# EAGLE schematic MultimeterOld (EAGLE 9.6.2)

## Sheet 1 of 2: ADC
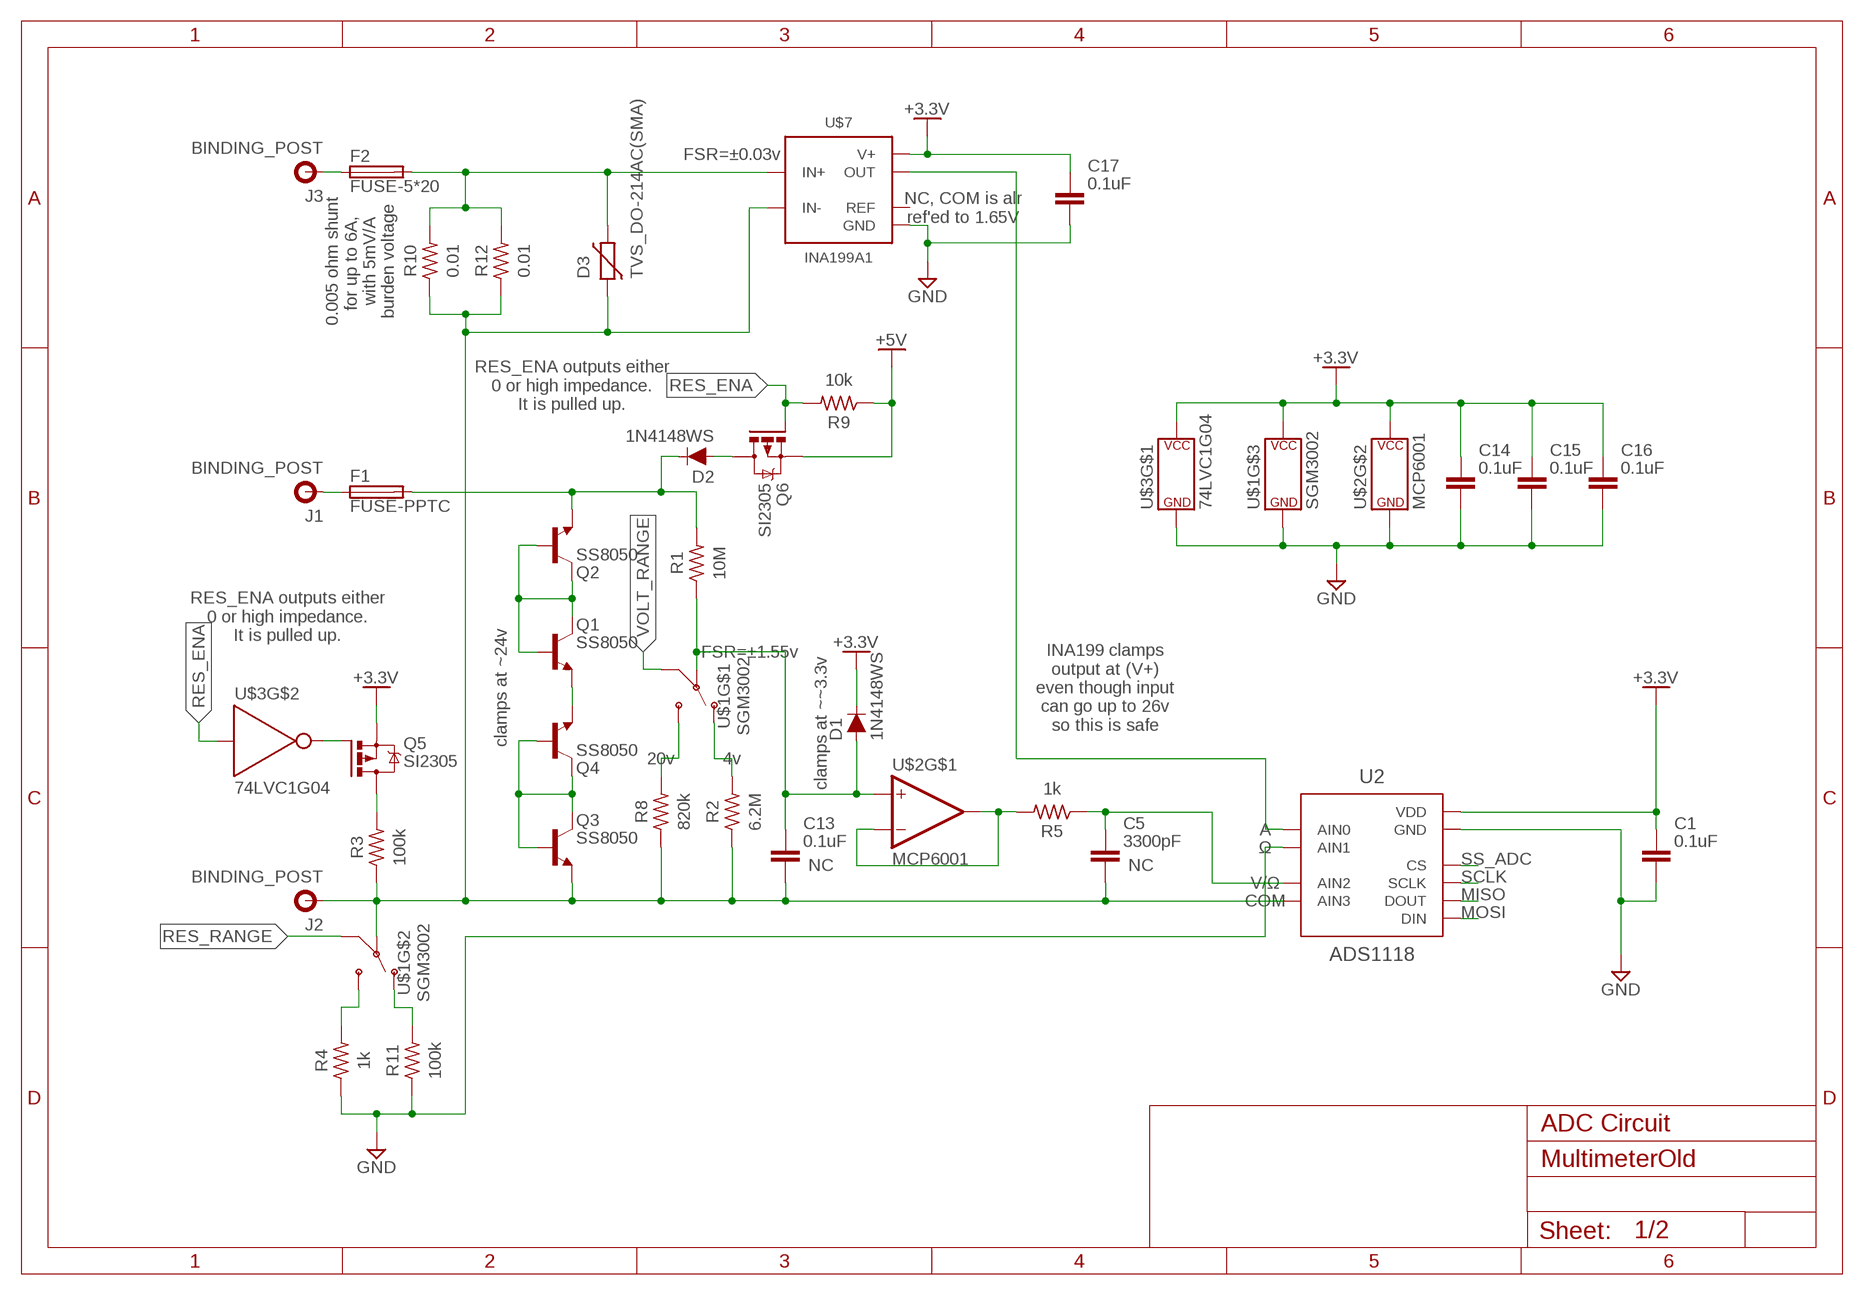
[diagram p0: schematic, sheet 1]

### Parts
C1  0.1uF  C_CHIP-0603(1608-METRIC)  [CAPC1608X85]
C5  3300pF  C_CHIP-0603(1608-METRIC)  [CAPC1608X85]
C13  0.1uF  C_CHIP-0603(1608-METRIC)  [CAPC1608X85]
C14  0.1uF  C_CHIP-0603(1608-METRIC)  [CAPC1608X85]
C15  0.1uF  C_CHIP-0603(1608-METRIC)  [CAPC1608X85]
C16  0.1uF  C_CHIP-0603(1608-METRIC)  [CAPC1608X85]
C17  0.1uF  C_CHIP-0603(1608-METRIC)  [CAPC1608X85]
D1  1N4148WS  DIODE  [SOD-323]
D2  1N4148WS  DIODE  [SOD-323]
D3  TVS_DO-214AC(SMA)  [DIOM5226X290N]
F1  FUSE-PPTC  [FUSE-PPTC-TH]
F2  FUSE-5*20  [FUSEHOLDER_"HD"]
J1  BINDING_POST  [BINDING_POST]
J2  BINDING_POST  [BINDING_POST]
J3  BINDING_POST  [BINDING_POST]
Q1  SS8050  NPN_SOT23  [SOT95P237X112-3N]
Q2  SS8050  NPN_SOT23  [SOT95P237X112-3N]
Q3  SS8050  NPN_SOT23  [SOT95P237X112-3N]
Q4  SS8050  NPN_SOT23  [SOT95P237X112-3N]
Q5  SI2305  PMOSFET_SOT23  [SOT23]
Q6  SI2305  PMOSFET_SOT23  [SOT23]
R1  10M  R-US_CHIP-0603(1608-METRIC)  [RESC1608X60]
R2  6.2M  R-US_CHIP-0603(1608-METRIC)  [RESC1608X60]
R3  100k  R-US_CHIP-0603(1608-METRIC)  [RESC1608X60]
R4  1k  R-US_CHIP-0603(1608-METRIC)  [RESC1608X60]
R5  1k  R-US_CHIP-0603(1608-METRIC)  [RESC1608X60]
R8  820k  R-US_CHIP-0603(1608-METRIC)  [RESC1608X60]
R9  10k  R-US_CHIP-0603(1608-METRIC)  [RESC1608X60]
R10  0.01  R-US_CHIP-2512(6332-METRIC)  [RESC6332X71]
R11  100k  R-US_CHIP-0603(1608-METRIC)  [RESC1608X60]
R12  0.01  R-US_CHIP-2512(6332-METRIC)  [RESC6332X71]
U2  ADS1118  [VSSOP10]
U$1  SGM3002  [MSOP10]
U$2  MCP6001  [SOT23-5]
U$3  74LVC1G04  [SOT23-5]
U$7  INA199A1  INA199  [SC70-6]

### Nets
+3.3V: C1.1 C14.1 C15.1 C16.1 C17.1 D1.C Q5.2(S) U2.8(VDD) U$1.8(P$V+) U$2.5(P$V+) U$3.5(P$V+) U$7.3(V+) ; also sheet 2
+5V: Q6.2(S) R9.1 ; also sheet 2
COM: C5.2 C13.2 D3.1 J2.P$1 Q3.1(E) R2.1 R3.1 R8.1 R10.1 R12.1 U2.7(AIN3) U$1.6(COM) U$7.5(IN-)
GND: C1.2 C14.2 C15.2 C16.2 C17.2 R4.1 R11.1 U2.3(GND) U2.5(AIN1) U$1.3(P$V-) U$2.2(P$V-) U$3.3(P$V-) U$7.2(GND) ; also sheet 2
MISO: U2.9(DOUT) ; also sheet 2
MOSI: U2.10(DIN) ; also sheet 2
N$1: D2.C F1.P$2 Q2.1(E) R1.2
N$3: C13.1 D1.A R1.1 U$1.10(COM) U$2.3(+IN)
N$4: D2.A Q6.3(D)
N$5: Q3.2(B) Q3.3(C) Q4.2(B) Q4.3(C)
N$6: F2.P$1 J3.P$1
N$8: R5.2 U$2.1(OUT) U$2.4(-IN)
N$11: C5.1 R5.1 U2.6(AIN2)
N$13: U2.4(AIN0) U$7.6(OUT)
N$14: R4.2 U$1.4(NO)
N$15: R8.2 U$1.2(NO)
N$16: R2.2 U$1.9(NC)
N$17: Q1.2(B) Q1.3(C) Q2.2(B) Q2.3(C)
N$18: Q1.1(E) Q4.1(E)
N$19: F1.P$1 J1.P$1
N$20: R11.2 U$1.7(NC)
N$21: D3.2 F2.P$2 R10.2 R12.2 U$7.4(IN+)
N$23: Q5.3(D) R3.2
N$25: Q5.1(G) U$3.4(Y)
RES_ENA: Q6.1(G) R9.2 U$3.2(A)
RES_RANGE: U$1.5(IN)
SCLK: U2.1(SCLK) ; also sheet 2
SS_ADC: U2.2(CS) ; also sheet 2
VOLT_RANGE: U$1.1(IN)
Unconnected: U$7.1(REF)

### Notes on the sheet
- FSR=±0.03v
- NC, COM is alr
  ref'ed to 1.65V
- 0.005 ohm shunt
  for up to 6A, 
  with 5mV/A
  burden voltage
- RES_ENA outputs either
  0 or high impedance.
  It is pulled up.
- RES_ENA outputs either
  0 or high impedance.
  It is pulled up.
- FSR=±1.55v
- clamps at ~24v
- INA199 clamps
  output at (V+)
  even though input
  can go up to 26v
  so this is safe
- clamps at ~~3.3v
- 20v | 4v
- A
- Ω
- NC | NC
- V/Ω
- COM
- ADC Circuit

## Sheet 2 of 2: MCU & Power
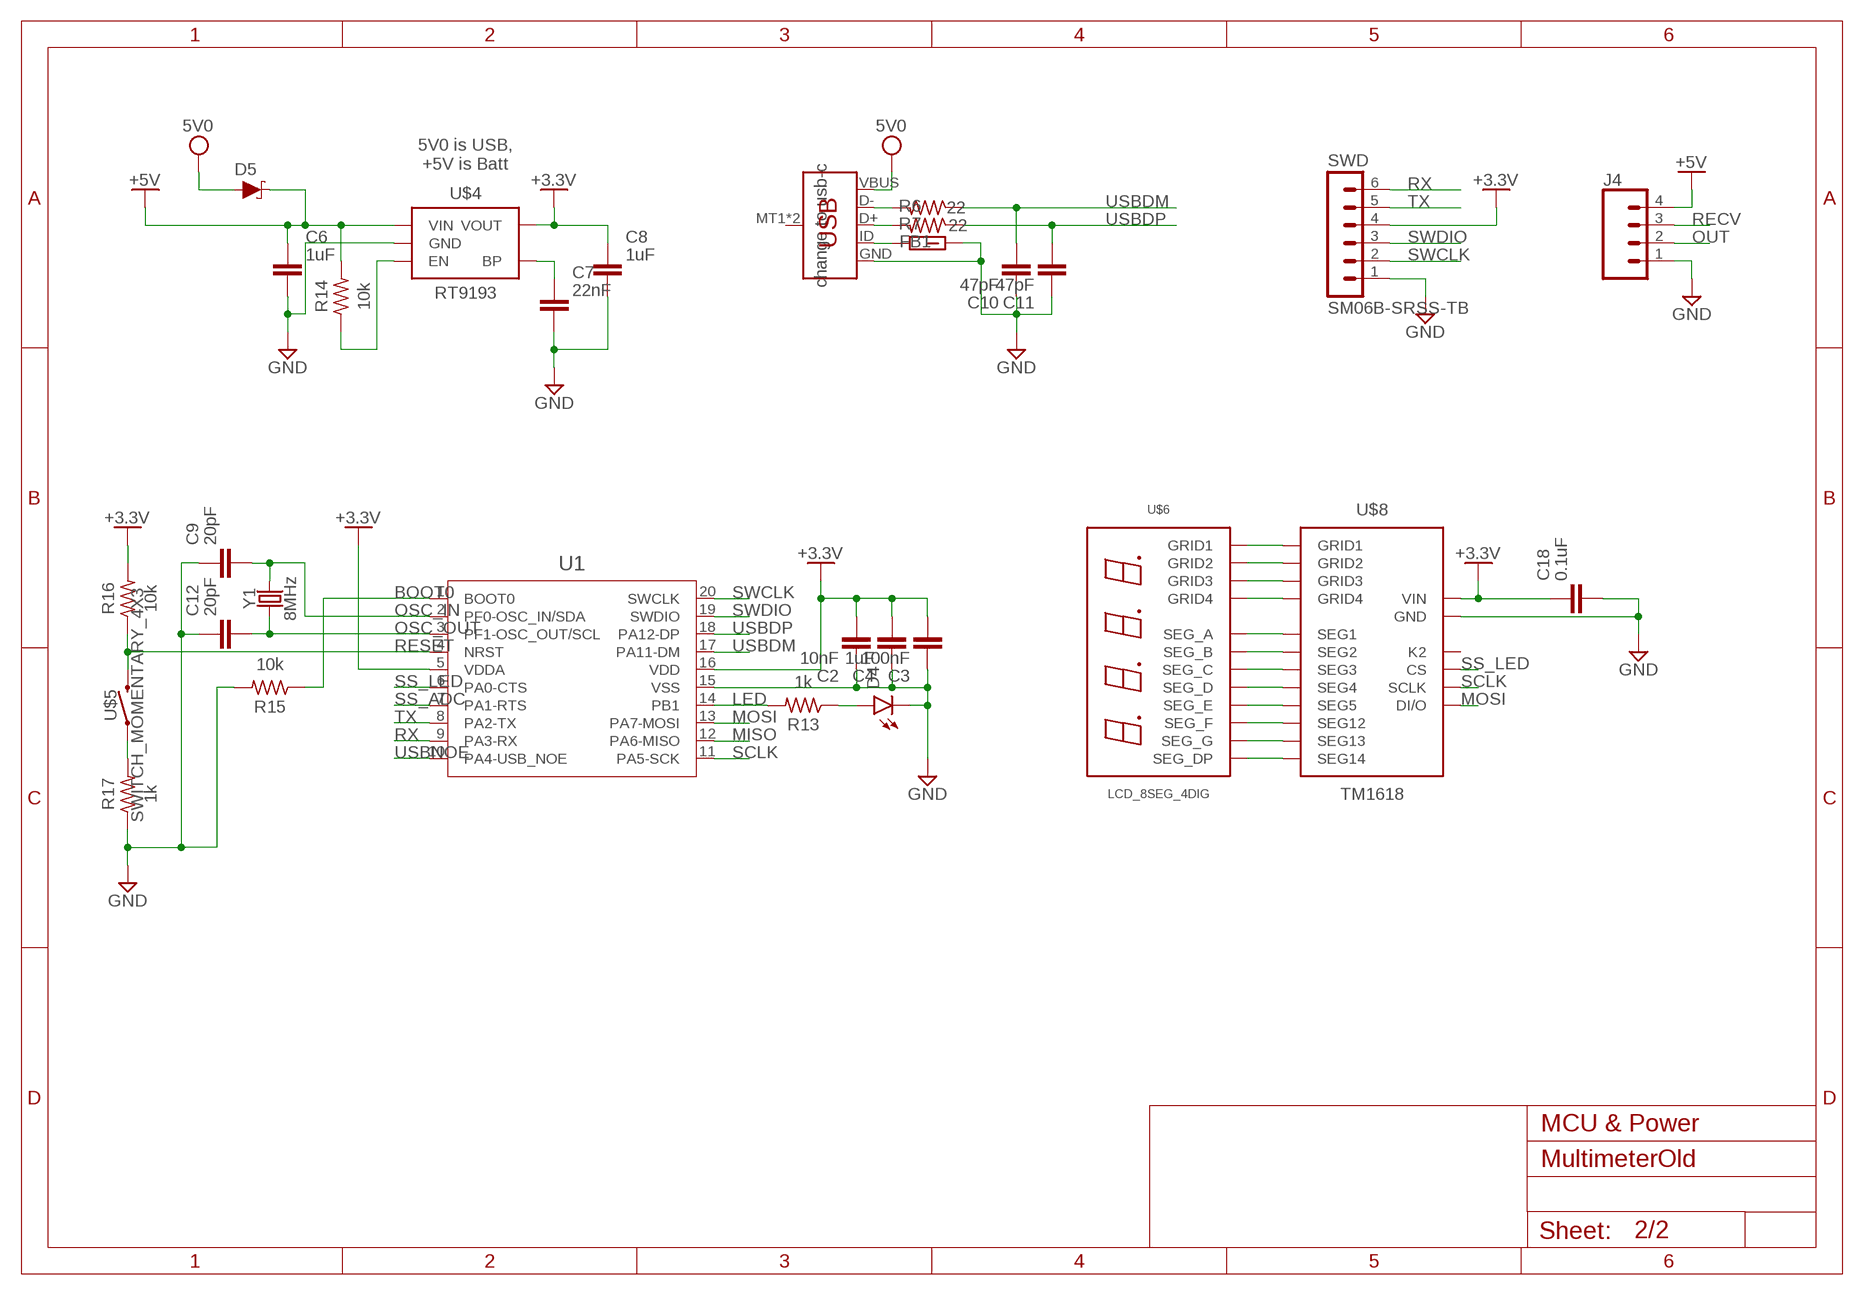
[diagram p1: schematic, sheet 2]

### Parts
C2  10nF  C_CHIP-0603(1608-METRIC)  [CAPC1608X85]
C3  100nF  C_CHIP-0603(1608-METRIC)  [CAPC1608X85]
C4  1uF  C_CHIP-0603(1608-METRIC)  [CAPC1608X85]
C6  1uF  C_CHIP-0603(1608-METRIC)  [CAPC1608X85]
C7  22nF  C_CHIP-0603(1608-METRIC)  [CAPC1608X85]
C8  1uF  C_CHIP-0603(1608-METRIC)  [CAPC1608X85]
C9  20pF  C_CHIP-0603(1608-METRIC)  [CAPC1608X85]
C10  47pF  C_CHIP-0603(1608-METRIC)  [CAPC1608X85]
C11  47pF  C_CHIP-0603(1608-METRIC)  [CAPC1608X85]
C12  20pF  C_CHIP-0603(1608-METRIC)  [CAPC1608X85]
C18  0.1uF  C_CHIP-0603(1608-METRIC)  [CAPC1608X85]
D4  LED_CHIP_BLUE-1608  [LEDC1608X39N_B]
D5  DIODE-SCHOTTKY  [SMA-DIODE]
FB1  1k  FBCHIP-0603(1608-METRIC)  [BEADC1608X95N]
J4  CONN_04LOCK  [1X04_LOCK]
R6  22  R-US_CHIP-0603(1608-METRIC)  [RESC1608X60]
R7  22  R-US_CHIP-0603(1608-METRIC)  [RESC1608X60]
R13  1k  R-US_CHIP-0603(1608-METRIC)  [RESC1608X60]
R14  10k  R-US_CHIP-0603(1608-METRIC)  [RESC1608X60]
R15  10k  R-US_CHIP-0603(1608-METRIC)  [RESC1608X60]
R16  10k  R-US_CHIP-0603(1608-METRIC)  [RESC1608X60]
R17  1k  R-US_CHIP-0603(1608-METRIC)  [RESC1608X60]
SWD  SM06B-SRSS-TB  [SM06B-SRSS-TB]
U1  STM32F070F6P6  [TSSOP20-M]
U$4  RT9193  [SOT23-5]
U$5  SWITCH_MOMENTARY_4X3  [MOMENTARY_SWITCH_4X3]
U$6  LCD_8SEG_4DIG  [LCD_8SEG_4DIG_0.4IN]
U$8  TM1618  [SOP-18]
X1  USB-MINIB  USB_MICRO-B  [USB-MICROB-CLEANED]
Y1  8MHz  CRYSTAL_5032  [CRYSTAL-SMD-5X3.2-2PAD]

### Nets
5V0: D5.A X1.VBUS
+3.3V: C2.2 C3.2 C4.2 C8.1 C18.1 R16.2 SWD.4 U1.5(VDDA) U1.16(VDD) U$4.5(VOUT) U$8.P5(VIN) ; also sheet 1
+5V: C6.1 D5.C J4.4 R14.2 U$4.1(VIN) ; also sheet 1
BOOT0: R15.1 U1.1(BOOT0)
GND: C2.1 C3.1 C4.1 C6.2 C7.2 C8.2 C9.1 C10.1 C11.1 C12.1 C18.2 D4.2(C) FB1.2 J4.1 R15.2 R17.1 SWD.1 U1.15(VSS) U$4.2(GND) U$8.P16(GND) X1.GND ; also sheet 1
LED: R13.2 U1.14(PB1)
MISO: U1.12(PA6-MISO) ; also sheet 1
MOSI: U1.13(PA7-MOSI) U$8.P1(DI/O) ; also sheet 1
N$2: FB1.1 X1.ID
N$7: D4.1(A) R13.1
N$9: R14.1 U$4.3(EN)
N$10: C7.1 U$4.4(BP)
N$12: R17.2 U$5.P$1
N$22: U$6.11(SEG_A) U$8.P6(SEG1)
N$24: U$6.7(SEG_B) U$8.P7(SEG2)
N$26: U$6.4(SEG_C) U$8.P8(SEG3)
N$27: U$6.2(SEG_D) U$8.P9(SEG4)
N$28: U$6.1(SEG_E) U$8.P10(SEG5)
N$29: U$6.10(SEG_F) U$8.P11(SEG12)
N$30: U$6.5(SEG_G) U$8.P12(SEG13)
N$31: U$6.3(SEG_DP) U$8.P13(SEG14)
N$32: U$6.6(GRID4) U$8.P14(GRID4)
N$33: U$6.8(GRID3) U$8.P15(GRID3)
N$34: U$6.9(GRID2) U$8.P17(GRID2)
N$35: U$6.12(GRID1) U$8.P18(GRID1)
N$59: R6.2 X1.D-
N$60: R7.2 X1.D+
OSC_IN: C9.2 U1.2(PF0-OSC_IN/SDA) Y1.P$2
OSC_OUT: C12.2 U1.3(PF1-OSC_OUT/SCL) Y1.P$1
OUT: J4.2
RECV: J4.3
RESET: R16.1 U1.4(NRST) U$5.P$2
RX: SWD.6 U1.9(PA3-RX)
SCLK: U1.11(PA5-SCK) U$8.P2(SCLK) ; also sheet 1
SS_ADC: U1.7(PA1-RTS) ; also sheet 1
SS_LED: U1.6(PA0-CTS) U$8.P3(CS)
SWCLK: SWD.2 U1.20(SWCLK)
SWDIO: SWD.3 U1.19(SWDIO)
TX: SWD.5 U1.8(PA2-TX)
USBDM: C10.2 R6.1 U1.17(PA11-DM)
USBDP: C11.2 R7.1 U1.18(PA12-DP)
USBNOE: U1.10(PA4-USB_NOE)
Unconnected: U$8.P4(K2) X1.MT1(SHIELD) X1.MT2(SHIELD)

### Notes on the sheet
- 5V0 is USB,
  +5V is Batt
- change to usb-c
- MCU & Power

## Library data of the parts
C1-C18 = Capacitor:C: Capacitor - Generic; CATEGORY: Capacitor
D1 D2 = JH:DIODE
D3 = Circuit-Protection:TVS: TVS Diode - Generic; CATEGORY: Circuit-Protection; SUB-CATEGORY: TVS-Diode
D4 = Opto-Electronic:LED_CHIP: LED - Generic; CATEGORY: Opto-Electronic; COLOR: Blue; SUB-CATEGORY: LED
D5 = JH:DIODE-SCHOTTKY
F1 F2 = JH:FUSE
FB1 = Filter:FB: Ferrite Bead - Generic; CATEGORY: Filter; SUB-CATEGORY: Ferrite bead
J1-J3 = Connectors:BINDING_POST: Binding Post The component itself has an threaded, insulated body that goes through the board, with a small threaded metal stud coming off the back. The intent of this package is that the post goes through a milled obling hole, and a small wire would be used to connect from the PCB pad to the metal contact on the post. SparkFun Products: SparkFun Decade Resistance Box <https://www.sparkfun.com/products/13006> SparkFun Benchtop Power Board Kit <https://www.sparkfun.com/products/12867> Binding Post - Red <https://www.sparkfun.com/products/9739> Binding Post - Black <https://www.sparkfun.com/products/9740>; PROD_ID: CONN-09675; SF_ID: PRT-09740
J4 = Connectors:CONN_04: Multi connection point. Often used as Generic Header-pin footprint for 0.1 inch spaced/style header connections On any of the 0.1 inch spaced packages, you can populate with these: Break Away Headers - Straight <https://www.sparkfun.com/products/116> (PRT-00116) Break Away Male Headers - Right Angle <https://www.sparkfun.com/products/553> (PRT-00553) Female Headers <https://www.sparkfun.com/products/115> (PRT-00115) Break Away Headers - Machine Pin <https://www.sparkfun.com/products/117> (PRT-00117) Break Away Female Headers - Swiss Machine Pin <https://www.sparkfun.com/products/743> (PRT-00743) For SCREWTERMINALS and SPRING TERMINALS visit here: Screw Terimnals on SparkFun.com <https://www.sparkfun.com/search/results?term=Screw+Terminals> (5mm/3.5mm/2.54mm spacing) This device is also useful as a general connection point to wire up your design to another part of your project. Our various solder wires solder well into these plated through hole pads. Hook-Up Wire - Assortment (Stranded, 22 AWG) <https://www.sparkfun.com/products/11375> (PRT-11375) Hook-Up Wire - Assortment (Solid Core, 22 AWG) <https://www.sparkfun.com/products/11367> (PRT-11367) View the entire wire category on our website here <https://www.sparkfun.com/categories/141> Special notes: Molex polarized connector foot print use with SKU : PRT-08231 with associated crimp pins and housings. 1MM SMD Version SKU: PRT-10208; PROD_ID: CONN-09696
Q1-Q4 = Transistor:NPN: NPN - Generic; CATEGORY: Transistor; SUB-CATEGORY: BJT; TYPE: NPN
Q5 Q6 = Transistor:PMOSFET: P-Channel MOSFET - Generic; CATEGORY: Transistor; SUB-CATEGORY: MOSFET; TYPE: P-Channel
R1-R17 = Resistor:R-US: Resistor Fixed - ANSI; CATEGORY: Resistor; SUB-CATEGORY: Fixed
SWD = con-JST SH:SM06B-SRSS: JST SH series header 1.00mm pitch disconnectable crimp style connectors, horizontal (side entry type), 6 pins
U1 = JH:STM32F070F6P6; BUILT_BY: EMA_Cory; COPYRIGHT: Copyright (C) 2018 Accelerated Designs. All rights reserved; DATASHEET: https://www.st.com/resource/en/datasheet/stm32f070f6.pdf; MANUFACTURER_PART_NUMBER: STM32F070F6P6; VENDOR: STMicroelectronics
U2 = JH:ADS1118; MANUFACTURER: Texas Instruments; PARTNUMBER: ADS1118IDGSR; REFDES: RefDes; TYPE: TYPE; VALUE: Value
U$1 = JH:SGM3002
U$2 = JH:MCP6001
U$3 = JH:74LVC1G04
U$4 = JH:RT9193
U$5 = JH:SWITCH_MOMENTARY
U$6 = JH:LCD_8SEG_4DIG
U$7 = JH:INA199
U$8 = JH:TM1618
X1 = Connectors:USB_MICRO-B: USB Type Micro-B Connector Male/female and PTH/SMT variants SparkFun Products: SparkFun microB USB Breakout <https://www.sparkfun.com/products/12035> SparkFun USB microB Plug Breakout <https://www.sparkfun.com/products/10031> SparkFun ESP8266 Thing <https://www.sparkfun.com/products/13231>
Y1 = JH:CRYSTAL: Crystals (Generic) These are passive quartz crystals, which can be used as a clock source for a microcontroller. Crystal's are two-terminal devices. They require external "load" capacitors to generate an oscillating signal.